# EAGLE design CameraTrigger (EAGLE 7.6.0)
CNAME: Aerometrex Multiple Camera Trigger; CREVISION: 1.3; DESIGNER: Tisham Dhar
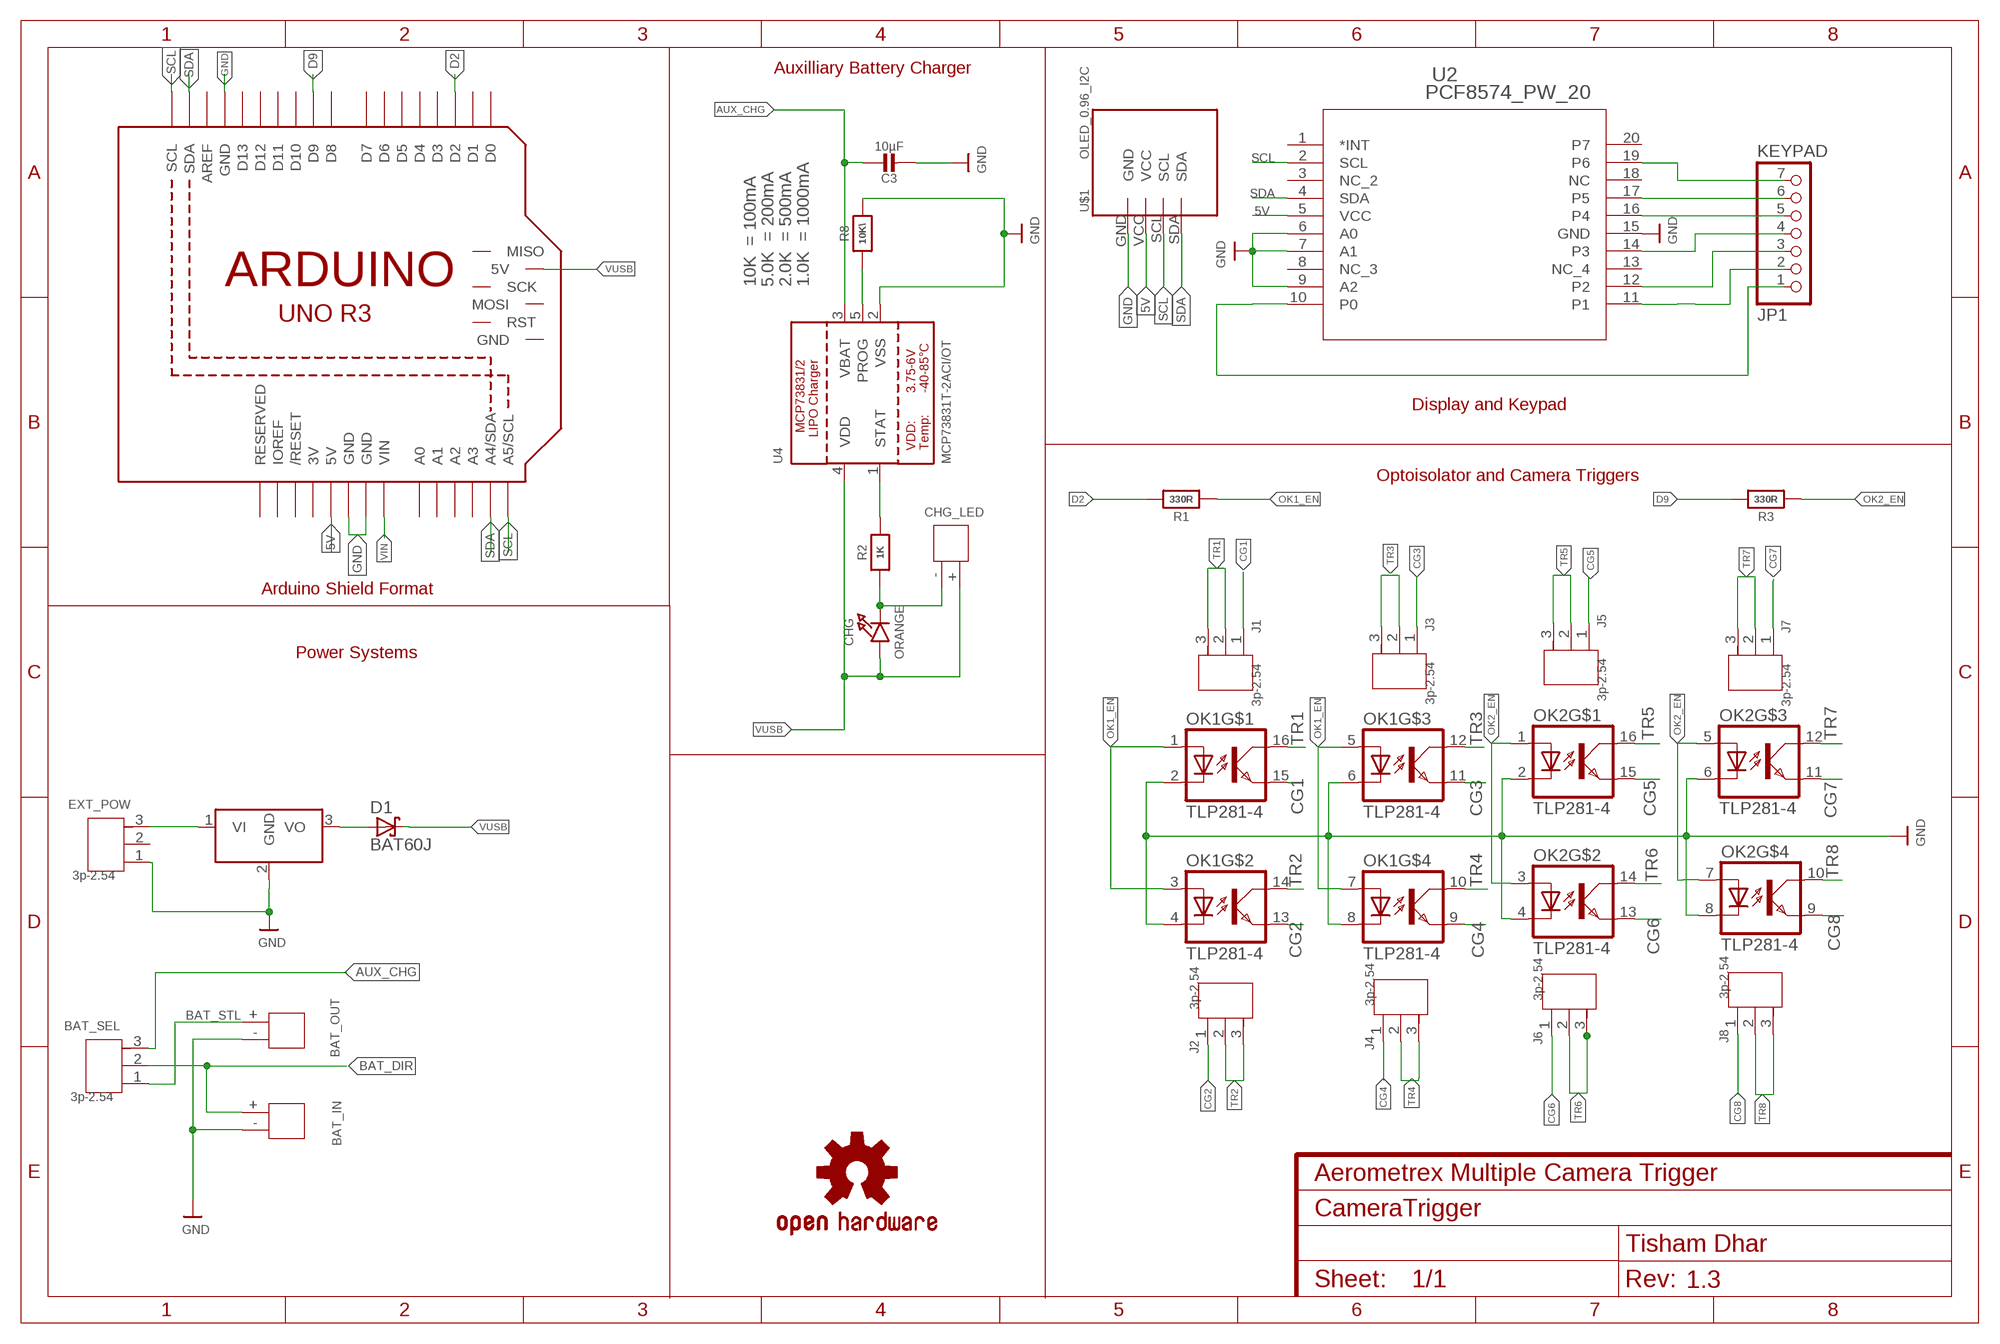
[diagram p0: schematic, sheet 1]

## Parts
BAT_IN  2p-2.0  DIP-JST-2P-2.0  [H2-2.0-6X4.5MM]
BAT_OUT  2p-2.0  DIP-JST-2P-2.0  [H2-2.0-6X4.5MM]
BAT_SEL  3p-2.54  DIP-FEMALE-JST(3P-2.54)  [HW3-2.54-7.62X6.6MM]
C3  10µF  CAP_CERAMIC0805-NOOUTLINE  [0805-NO]
CHG  ORANGE  LED0805_NOOUTLINE  [CHIPLED_0805_NOOUTLINE]
CHG_LED  2p-2.0  DIP-JST-2P-2.0  [H2-2.0-6X4.5MM]
D1  BAT60J  [SOD323_ST]
EXT_POW  3p-2.54  DIP-FEMALE-JST(3P-2.54)  [HW3-2.54-7.62X6.6MM]
J1  3p-2.54  DIP-FEMALE-JST(3P-2.54)  [HW3-2.54-7.62X6.6MM]
J2  3p-2.54  DIP-FEMALE-JST(3P-2.54)  [HW3-2.54-7.62X6.6MM]
J3  3p-2.54  DIP-FEMALE-JST(3P-2.54)  [HW3-2.54-7.62X6.6MM]
J4  3p-2.54  DIP-FEMALE-JST(3P-2.54)  [HW3-2.54-7.62X6.6MM]
J5  3p-2.54  DIP-FEMALE-JST(3P-2.54)  [HW3-2.54-7.62X6.6MM]
J6  3p-2.54  DIP-FEMALE-JST(3P-2.54)  [HW3-2.54-7.62X6.6MM]
J7  3p-2.54  DIP-FEMALE-JST(3P-2.54)  [HW3-2.54-7.62X6.6MM]
J8  3p-2.54  DIP-FEMALE-JST(3P-2.54)  [HW3-2.54-7.62X6.6MM]
JP1  KEYPAD  PINHD-1X7  [1X07]
LOGO1  OSHW-LOGOM  [OSHW-LOGO-M]
M1  ARDUINO_R3_ICSP  [ARDUINOR3_ICSP]
OK1  TLP281-4  [MINI-FLAT-16]
OK2  TLP281-4  [MINI-FLAT-16]
OKI-78SR-5  DCDC_OKI-78SR  [OKI-78SRH]
R1  330R  RESISTOR_0603_NOOUT  [0603-NO]
R2  1K  RESISTOR_0603_NOOUT  [0603-NO]
R3  330R  RESISTOR_0603_NOOUT  [0603-NO]
R8  10K\  RESISTOR_0603_NOOUT  [0603-NO]
U2  PCF8574_PW_20  [PW20]
U4  MCP73831T-2ACI/OT  MCP73831/2  [SOT23-5]
U$1  OLED_0.96_I2C  [OLED_0.96_I2C]

## Nets
5V [PWR]: M1.5V U2.5(VCC) U$1.VCC
AUX_CHG [PWR]: BAT_SEL.3 C3.1 U4.3(VBAT)
BAT_DIR [PWR]: BAT_IN.+ BAT_SEL.2
BAT_STL [PWR]: BAT_OUT.+ BAT_SEL.1
CG1: J1.1 OK1.15(EMIT)
CG2: J2.1 OK1.13(EMIT)
CG3: J3.1 OK1.11(EMIT)
CG4: J4.1 OK1.9(EMIT)
CG5: J5.1 OK2.15(EMIT)
CG6: J6.1 OK2.13(EMIT)
CG7: J7.1 OK2.11(EMIT)
CG8: J8.1 OK2.9(EMIT)
D2: M1.D2 R1.2
D9: M1.D9 R3.2
GND [PWR]: BAT_IN.- BAT_OUT.- C3.2 EXT_POW.1 M1.GND M1.GND@1(GND) M1.GND@3(GND) OK1.2(C) OK1.4(C) OK1.6(C) OK1.8(C) OK2.2(C) OK2.4(C) OK2.6(C) OK2.8(C) OKI-78SR-5.2(GND) R8.2 U2.6(A0) U2.7(A1) U2.9(A2) U2.15(GND) U4.2(VSS) U$1.GND
K1: JP1.1 U2.10(P0)
K2: JP1.2 U2.11(P1)
N$1: CHG.C CHG_LED.- R2.1
N$2 [PWR]: D1.A OKI-78SR-5.3(VO)
N$3: R2.2 U4.1(STAT)
N$4: R8.1 U4.5(PROG)
N$32: JP1.7 U2.19(P6)
N$33: JP1.6 U2.17(P5)
N$34: JP1.5 U2.16(P4)
N$36: JP1.4 U2.14(P3)
N$37: JP1.3 U2.12(P2)
OK1_EN: OK1.1(A) OK1.3(A) OK1.5(A) OK1.7(A) R1.1
OK2_EN: OK2.1(A) OK2.3(A) OK2.5(A) OK2.7(A) R3.1
SCL: M1.A5(A5/SCL) M1.SCL U2.2(SCL) U$1.SCL
SDA: M1.A4(A4/SDA) M1.SDA U2.4(SDA) U$1.SDA
TR1: J1.2 J1.3 OK1.16(COL)
TR2: J2.2 J2.3 OK1.14(COL)
TR3: J3.2 J3.3 OK1.12(COL)
TR4: J4.2 J4.3 OK1.10(COL)
TR5: J5.2 J5.3 OK2.16(COL)
TR6: J6.2 J6.3 OK2.14(COL)
TR7: J7.2 J7.3 OK2.12(COL)
TR8: J8.2 J8.3 OK2.10(COL)
VEXT [PWR]: EXT_POW.3 OKI-78SR-5.1(VI)
VIN [PWR]: M1.VIN
VUSB [PWR]: CHG.A CHG_LED.+ D1.C M1.5V_ICSP(5V) U4.4(VDD)
Unconnected: EXT_POW.2 M1.A0 M1.A1 M1.A2 M1.A3 M1.AREF M1.D0 M1.D1 M1.D3 M1.D4 M1.D5 M1.D6 M1.D7 M1.D8 M1.D10 M1.D11 M1.D12 M1.D13 M1.GND@2(GND) M1.IOREF M1.MISO M1.MOSI M1.RESERVED M1.RESET(/RESET) M1.RESET_ICSP(RST) M1.SCK U2.1(*INT) U2.3(NC_2) U2.8(NC_3) U2.13(NC_4) U2.18(NC) U2.20(P7)

## Notes on the sheet
- Auxilliary Battery Charger
- 10K  = 100mA | 5.0K  = 200mA | 2.0K  = 500mA | 1.0K  = 1000mA
- Display and Keypad
- Optoisolator and Camera Triggers
- Arduino Shield Format
- Power Systems

## Power pins joined to a net without a drawn wire
3V: M1.3V

## Library data of the parts
BAT_IN BAT_OUT CHG_LED = Seeed-OPL-Connector:DIP-JST-2P-2.0: 320110049
BAT_SEL EXT_POW J1-J8 = Seeed-OPL-Connector:DIP-FEMALE-JST(3P-2.54): 320110056; MPN: B101-103A0BSBA1
C3 = microbuilder:CAP_CERAMIC: Ceramic Capacitors For new designs, use the packages preceded by an '_' character since they are more reliable: The following footprints should be used on most boards: _0402 - Standard footprint for regular board layouts _0603 - Standard footprint for regular board layouts _0805 - Standard footprint for regular board layouts _1206 - Standard footprint for regular board layouts For extremely tight-pitch boards where space is at a premium, the following 'micro-pitch' footprints can be used (smaller pads, no silkscreen outline, etc.): _0402MP - Micro-pitch footprint for very dense/compact boards _0603MP - Micro-pitch footprint for very dense/compact boards _0805MP - Micro-pitch footprint for very dense/compact boards _1206MP - Micro-pitch footprint for very dense/compact boards
CHG = microbuilder:LED: LED 0603 - 0603 Surface Mount Package 2mA: Green LED - Low Power (3.9mcd, 2ma, 1.7Vf) - Digikey: 475-2709-2-ND Orange LED - Low Power (9.8mcd, 2ma, 1.8Vf) - Digikey: 475-1194-2-ND Red LED - Low Power (5mcd, 2ma, 1.8Vf) - Digikey: 475-1195-2-ND Yellow LED - Low Power (7mcd, 2ma, 1.8Vf) - Digikey: 475-1196-2-ND 5mA: Blue LED - Low Power (17mcd, 5ma, 2.9Vf) - Digikey: LNJ937W8CRACT-ND 0805 - 0805 Surface Mount Package 2mA: Red LED (8.8mcd, 2mA, 1.8Vf, Clear) - Low Power [Digikey: 475-2510-1-ND] Green LED (5mcd, 2mA, 1.8Vf, Clear) - Low Power [Digikey: 475-2730-1-ND] Yellow LED (11.3mcd, 2mA, 1.8Vf, Clear) - Low Power [Digikey: 475-2555-1-ND] 20mA: Red LED (104mcd, 20mA, Diffused) - LS R976 [Digikey: 475-1278-6-ND] Red LED (12mcd, 20mA, 2.0Vf, Clear) - APT2012EC [Digikey: 754-1128-1-ND] Green LED (15mcd, 20mA, 2.2Vf, Clear) - APT2012GC [Digikey: 754-1131-1-ND] Orange LED (160mcd, 20mA, 2.1Vf, Clear) - APT2012SECK [Digikey: 754-1130-1-ND] 1206 - 1206 Surface Mount Package Green LED (26mcd, 20mA, Diffused) - LG N971 [Digikey: 475-1407-6-ND] Red LED (15mcd, 20mA, Diffused) - LH N974 [Digikey: 475-1416-6-ND] Cree - Cree High-Power Surface Mount LEDs XPEBWT-L1-0000-00D50 - White 111lm 350mA 2.9Vf 6200K 110° XTEAWT-00-0000-00000LEE3 - White 114lm 350mA 2.85Vf 5000K 115° Everlight - Everlight 45-21 Series Surface Mount LEDs 45-21/QK2C-B2832AC2CB2/2T - Warm White 2000mcd 20mA 3.25Vf 3050K 120° 45-21/LK2C-B38452C4CB2/2T - Nuetral White 2000mcd 20mA 3.25Vf 4150K 120° 45-21/LK2C-B50634C6CB2/2T - Cold White 2200mcd 20mA 3.25Vf 5650K 120° PLCC2 Reverse Mount LS T77K-J1L2-1-0-2-R18-Z - Red 11.25mcd 2mA 1.8Vf 630nm 120° LO T77K-L1M2-24-Z - Orange 19.6mcd 2mA 1.8Vf 606nm 120° LY T77K-K2M1-26-Z - Yellow 15.7mcd 2mA 1.8Vf 587nm 120°
D1 = diode:BAT60J: Schottky barrier diode Source: www.st.com, BAT60J.pdf
JP1 = pinhead:PINHD-1X7: PIN HEADER
LOGO1 = SparkFun-Aesthetics:OSHW-LOGO: Open Source Hardware Logo This logo indicates the piece of hardware it is found on incorporates a OSHW license and/or adheres to the definition of open source hardware found here: http://freedomdefined.org/OSHW
M1 = adafruit:ARDUINO_R3_ICSP
OK1 OK2 = optocoupler:TLP281-4: TOSHIBA PHOTOCOUPLER GaAs IRED & PHOTO-TRANSISTOR Source: http://www.alldatasheet.com/datasheet-pdf/pdf/32424/TOSHIBA/TLP281.html214960/TOSHIBA/TLP281-4.html
OKI-78SR-5 = carrilib:DCDC_OKI-78SR: 4.95W DC/DC Converter Manufacturer: Murata Part Number: OKI-78SR-5/1.5-W36H-C OKI-78SR-3.3/1.5-W36H-C
R1-R3 R8 = microbuilder:RESISTOR: Resistors For new designs, use the packages preceded by an '_' character since they are more reliable: The following footprints should be used on most boards: _0402 - Standard footprint for regular board layouts _0603 - Standard footprint for regular board layouts _0805 - Standard footprint for regular board layouts _1206 - Standard footprint for regular board layouts For extremely tight-pitch boards where space is at a premium, the following 'micro-pitch' footprints can be used (smaller pads, no silkscreen outline, etc.): _0402MP - Micro-pitch footprint for very dense/compact boards _0603MP - Micro-pitch footprint for very dense/compact boards _0805MP - Micro-pitch footprint for very dense/compact boards _1206MP - Micro-pitch footprint for very dense/compact boards
U2 = PCF8574:PCF8574_PW_20; DATASHEETURL: http://www.ti.com/lit/gpn/PCF8574; DESCRIPTION: Remote 8-Bit I/O Expander for I2C-Bus; FAMILY_NAME: I2C IO EXPANDER; GENERIC_PART_NUMBER: PCF8574; INDUSTRY_STD_PKG_TYPE: TSSOP; MANUFACTURER: Texas Instruments; MANUFACTURER_PART_NUMBER: pcf8574_pw_20; PACKAGE_DESIGNATOR: PW; PIN_COUNT: 20; VENDOR: Texas Instruments
U4 = microbuilder:MCP73831/2: MCP73831/2 LIPO Charger VDD: 3.75 - 6V Temp -40 - 85°C Programmable Charge Rate: 15-500mA NOTE: STAT is a tri-state logic output on the MCP73831 and an open-drain output on the MCP73832. SOT23-5 with 4.2V output and tri-state logic on STAT = MCP73831T-2ACI/OT
U$1 = tft_1.8_1.44_oled_0.96:OLED_0.96_I2C

## Net classes
0 default: width 0.254 mm, drill 0.33 mm, clearance 0.203 mm
1 PWR: width 0.406 mm, drill 0.356 mm, clearance 0.254 mm

## Board
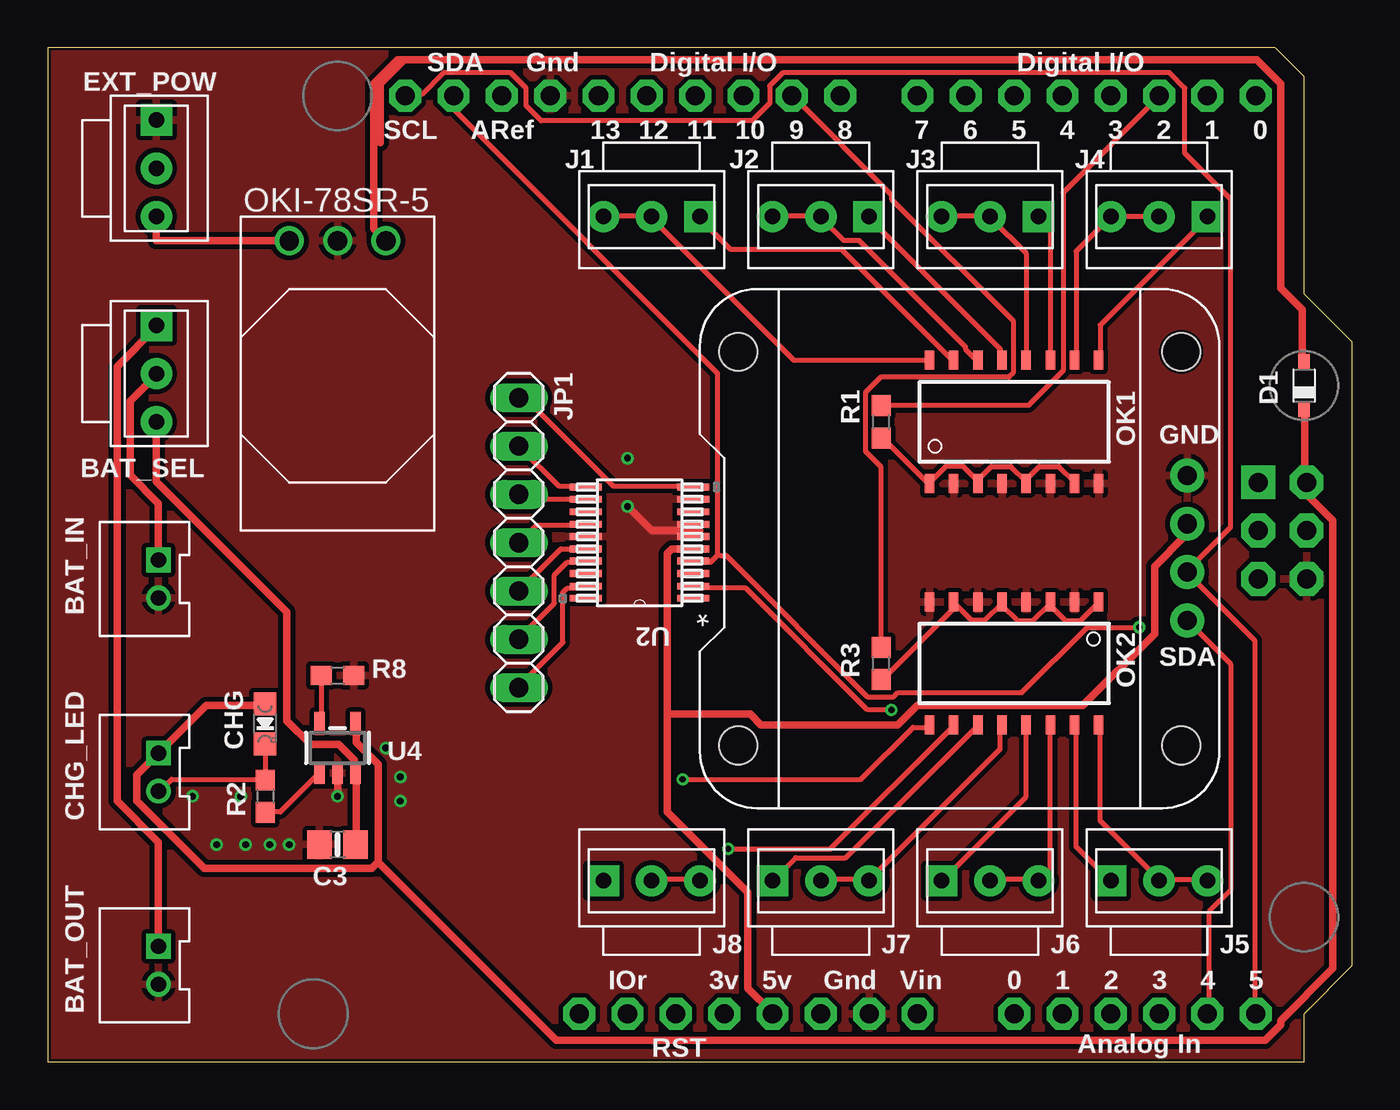
[diagram p1: board, top side]
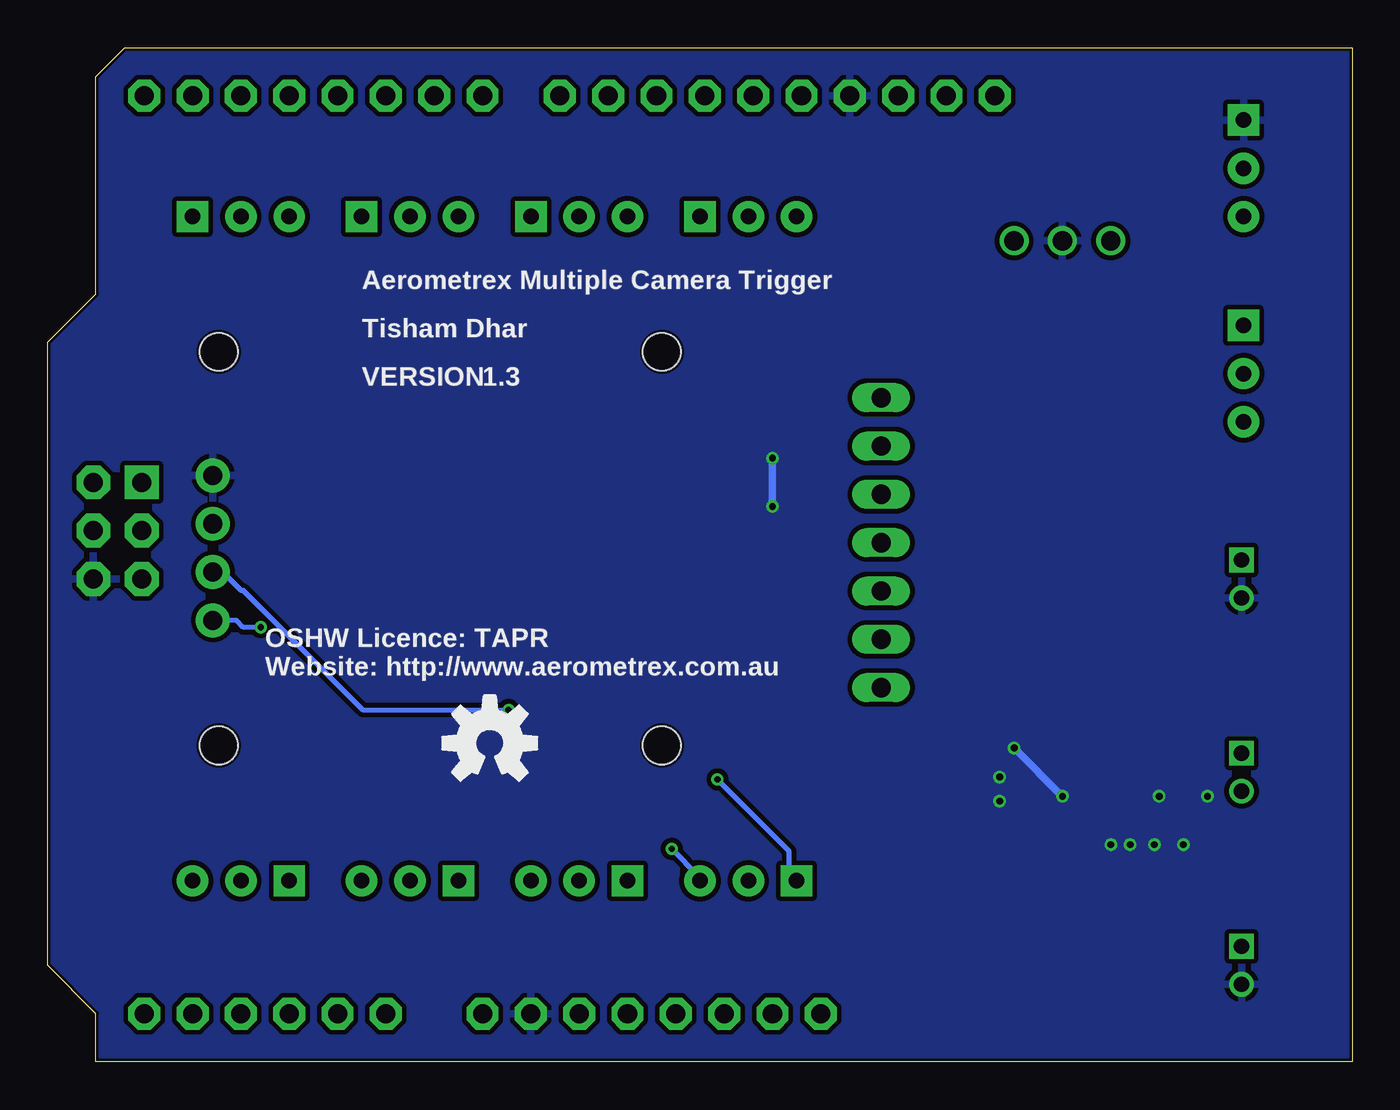
[diagram p2: board, bottom side, seen from below]

Size 68.58 x 53.34 mm. Coordinates in mm from the lower left corner, seen from the top.
Copper layers (1*16): Top 0.035mm / dielectric 1.5mm / Bottom 0.035mm
Design rules "hackvana": minimum track width 6mil, minimum drill 0.3mm, track to track 6mil, track to pad 6mil, pad to pad 6mil, via to via 6mil, smd to smd 0mil, copper to edge 6mil, drill to drill 6mil, minimum pad ring 10mil, minimum via ring 6mil, stop-mask expansion 2mil, vias tented up to drill 100mil, thermal gap 10mil

### Footprints (pad centres in the part's own frame; a part is rotated, then mirrored left to right if it is on the bottom)
H2-2.0-6X4.5MM = drill 0.8 pad 1.3 square: + -1,0.75 | drill 0.8 pad 1.3: - 1,0.75
HW3-2.54-7.62X6.6MM = drill 0.813 pad 1.651 square: 1 2.54,0 | drill 0.813 pad 1.651: 2 0,0; 3 -2.54,0
0805-NO = smd 1.3 x 1.5: 1 -0.95,0; 2 0.95,0
CHIPLED_0805_NOOUTLINE = smd 1.2 x 1.2: A 0,-1.05; C 0,1.05
SOD323_ST = smd 0.8 x 0.6: A 1.25,0; C -1.25,0
1X07 = drill 1.016 long: 1 -7.62,0; 2 -5.08,0; 3 -2.54,0; 4 0,0; 5 2.54,0; 6 5.08,0; 7 7.62,0
ARDUINOR3_ICSP = drill 1 pad 1.676 octagon: 3V 35.56,2.54; 5V 38.1,2.54; A0 50.8,2.54; A1 53.34,2.54; A2 55.88,2.54; A3 58.42,2.54; A4 60.96,2.54; A5 63.5,2.54; AREF 23.876,50.8; D0 63.5,50.8; D1 60.96,50.8; D2 58.42,50.8; D3 55.88,50.8; D4 53.34,50.8; D5 50.8,50.8; D6 48.26,50.8; D7 45.72,50.8; D8 41.656,50.8; D9 39.116,50.8; D10 36.576,50.8; D11 34.036,50.8; D12 31.496,50.8; D13 28.956,50.8; GND 26.416,50.8; GND@1 43.18,2.54; GND@2 40.64,2.54; IOREF 30.48,2.54; RESERVED 27.94,2.54; RESET 33.02,2.54; SCL 18.796,50.8; SDA 21.336,50.8; VIN 45.72,2.54 | drill 1 pad 1.778 octagon: 5V_ICSP 66.167,30.48; GND@3 66.167,25.4; MOSI 66.167,27.94; RESET_ICSP 63.627,25.4; SCK 63.627,27.94 | drill 1 pad 1.778 square: MISO 63.627,30.48
MINI-FLAT-16 = smd 1 x 0.5: 1 -3.24,4.445; 2 -3.24,3.175; 3 -3.24,1.905; 4 -3.24,0.635; 5 -3.24,-0.635; 6 -3.24,-1.905; 7 -3.24,-3.175; 8 -3.24,-4.445; 9 3.24,-4.445; 10 3.24,-3.175; 11 3.24,-1.905; 12 3.24,-0.635; 13 3.24,0.635; 14 3.24,1.905; 15 3.24,3.175; 16 3.24,4.445
OKI-78SRH = drill 1.016: 1 2.54,0; 2 0,0; 3 -2.54,0
0603-NO = smd 1.1 x 1: 1 -0.85,0; 2 0.85,0
PW20 = smd 1.676 x 0.356: 1 -2.819,2.921; 2 -2.819,2.286; 3 -2.819,1.626; 4 -2.819,0.965; 5 -2.819,0.33; 6 -2.819,-0.33; 7 -2.819,-0.965; 8 -2.819,-1.626; 9 -2.819,-2.286; 10 -2.819,-2.921; 11 2.819,-2.921; 12 2.819,-2.286; 13 2.819,-1.626; 14 2.819,-0.965; 15 2.819,-0.33; 16 2.819,0.33; 17 2.819,0.965; 18 2.819,1.626; 19 2.819,2.286; 20 2.819,2.921
SOT23-5 = smd 0.55 x 1.2: 1 -0.95,-1.3; 2 0,-1.3; 3 0.95,-1.3; 4 0.95,1.3; 5 -0.95,1.3
OLED_0.96_I2C = drill 1 pad 1.778: GND -4.17,11.63; SCL 0.91,11.63; SDA 3.45,11.63; VCC -1.63,11.63 | hole 2: -10.67,-11.97; 10.03,-11.97; 10.03,11.33; -10.67,11.33

### Placement (x,y rotation side)
BAT_IN  5.08,25.4 270 top
BAT_OUT  5.08,5.08 270 top
BAT_SEL  5.71,36.2 90 top
C3  15.24,11.43 180 top
CHG  11.43,17.78 180 top
CHG_LED  5.08,15.24 270 top
D1  66.04,35.56 90 top
EXT_POW  5.71,46.99 90 top
J1  31.75,44.45 0 top
J2  40.64,44.45 0 top
J3  49.53,44.45 0 top
J4  58.42,44.45 0 top
J5  58.42,9.53 180 top
J6  49.53,9.53 180 top
J7  40.64,9.53 180 top
J8  31.75,9.53 180 top
JP1  24.77,27.3 270 top
LOGO1  45.34,16.76 0 bottom
M1  0,0 0 top
OK1  50.8,33.66 90 top
OK2  50.8,20.95 270 top
OKI-78SR-5  15.24,43.18 180 top
R1  43.81,33.66 90 top
R2  11.43,13.97 270 top
R3  43.81,20.95 90 top
R8  15.24,20.32 0 top
U2  31.11,27.3 180 top
U4  15.24,16.51 0 top
U$1  48.26,26.67 270 top

### Tracks (layer width: path | path; a pad name or v marks a point on that pad's centre or on a via)
5V
  Top 0.406: 32.58,18.29 32.58,13.14 36.8,8.91 36.8,3.89 38.06,2.63 M1.5V | 32.58,18.29 32.58,26.75 32.8,26.98 33.83,26.98 U2.5 | U$1.VCC 59.78,28.23 59.78,27.66 58.18,26.06 58.18,22.52 54.41,18.75 45.72,18.75 44.69,17.72 37.49,17.72 36.92,18.29 32.69,18.29 32.58,18.29
AUX_CHG
  Top 0.406: C3.1 16.23,11.43 16.23,15.2 U4.3 16.12,15.32 16.12,15.89 15.32,16.69 13.83,16.69 12.57,17.95 12.57,23.66 5.71,30.52 5.71,33.6 BAT_SEL.3
BAT_DIR
  Top 0.406: BAT_IN.+ 5.83,29.38 4.34,30.86 4.34,34.75 5.71,36.12 BAT_SEL.2
BAT_STL
  Top 0.406: BAT_OUT.+ 5.83,6.17 5.83,11.54 3.66,13.72 3.66,36.58 5.71,38.63 BAT_SEL.1
CG1
  Top 0.254: OK1.15 47.55,36.92 41.72,42.75 35.89,42.75 34.29,44.35 J1.1
CG2
  Top 0.254: OK1.13 50.06,36.92 50.06,37.49 43.2,44.35 J2.1
CG3
  Top 0.254: OK1.11 52.69,36.92 52.69,43.78 52.12,44.35 J3.1
CG4
  Top 0.254: OK1.9 55.32,36.92 55.32,38.75 60.92,44.35 J4.1
CG5
  Top 0.254: OK2.15 54.06,17.6 54.06,11.32 55.78,9.6 J5.1
CG6
  Top 0.254: OK2.13 51.44,17.6 51.44,13.95 47.09,9.6 J6.1
CG7
  Top 0.254: OK2.11 48.81,17.6 41.95,10.74 39.32,10.74 38.18,9.6 J7.1
CG8  (via drill 0.33)
  Top 0.254: v33.38,14.86 42.75,14.86 45.49,17.6 46.29,17.6 OK2.9
  Bottom 0.254: v33.38,14.86 29.6,11.09 29.6,9.94 29.26,9.6 J8.1
D2
  Top 0.254: R1.2 43.89,34.52 51.55,34.52 53.38,36.35 53.38,45.72 58.41,50.75 M1.D2
D9
  Top 0.254: R3.2 43.78,21.83 43.78,31.32 42.98,32.12 42.98,35.2 43.78,36.01 50.52,36.01 50.75,36.23 50.75,38.98 44.35,45.38 44.35,45.61 39.2,50.75 M1.D9
GND  (via drill 0.36)
  Top 0.406: v30.48,29.21 31.75,27.94 34.29,27.94 U2.6 | U4.2 15.24,15.24 U4.2 | U4.2 v15.24,13.97
  Bottom 0.406: v30.48,29.21 v30.48,31.75 | v15.24,13.97 v17.78,16.51
  other vias: 7.62,13.97 8.89,11.43 10.16,13.97 11.68,11.43 18.54,14.99 18.54,13.72 12.7,11.43 10.41,11.43
  pour Bottom: 0,53.34 68.58,53.34 68.58,0 0,0
  pour Top: 0,53.34 68.58,53.34 68.58,0 0,0
K1
  Top 0.254: U2.10 33.83,30.29 29.72,30.29 25.15,34.86 24.8,34.86 JP1.1
K2
  Top 0.254: U2.11 28.23,30.29 26.86,30.29 24.8,32.35 JP1.2
N$1
  Top 0.254: CHG.C 11.43,16.69 11.43,14.86 R2.1 11.32,14.86 6.51,14.86 5.94,14.29 CHG_LED.-
N$2
  Top 0.406: 19.05,52.69 18.75,52.69 17.49,51.44 17.49,48.35 | 19.05,52.69 63.55,52.69 64.81,51.44 64.81,40.69 65.95,39.55 65.95,36.92 D1.A | OKI-78SR-5.3 17.14,43.81 17.14,51.44 18.41,52.7 19.05,52.7 19.05,52.69
N$3
  Top 0.254: R2.2 11.43,13.14 12.23,13.14 U4.1
N$4
  Top 0.254: R8.1 14.4,20.23 14.4,17.83 U4.5
N$32
  Top 0.254: U2.19 28.23,24.92 27.32,24.92 27.09,24.69 27.09,22.06 24.8,19.77 JP1.7
N$33
  Top 0.254: U2.17 28.23,26.29 27.32,26.29 26.63,25.6 26.63,24.12 24.8,22.29 JP1.6
N$34
  Top 0.254: U2.16 28.23,26.98 26.98,26.98 24.8,24.8 JP1.5
N$36
  Top 0.254: U2.14 28.23,28.23 25.72,28.23 24.8,27.32 JP1.4
N$37
  Top 0.254: U2.12 28.23,29.6 25.03,29.6 24.8,29.83 JP1.3
OK1_EN
  Top 0.254: OK1.7 53.95,30.52 53.15,31.32 52.12,31.32 51.44,30.63 OK1.5 51.44,30.52 50.63,31.32 49.61,31.32 48.92,30.63 OK1.3 48.92,30.52 48.12,31.32 47.21,31.32 46.41,30.52 OK1.1 46.29,30.4 43.89,32.8 R1.1
OK2_EN
  Top 0.254: 47.78,24 48.58,23.2 49.26,23.2 50.18,24.12 OK2.5 50.18,24 50.98,23.2 51.78,23.2 52.69,24.12 OK2.3 52.69,24 53.49,23.2 54.29,23.2 55.21,24.12 OK2.1 | 47.78,24 47.66,24.12 OK2.7 47.78,24 | 47.78,24 43.89,20.12 R3.1
SCL  (via drill 0.33)
  Top 0.254: v44.35,18.52 43.09,18.52 36.69,24.92 33.95,24.92 U2.2 | M1.A5 63.44,2.63 63.44,22.17 59.89,25.72 U$1.SCL 59.89,25.83 62.18,28.12 62.18,45.38 59.78,47.78 59.78,51.21 58.98,52.01 38.63,52.01 37.95,51.32 37.95,50.41 37.03,49.49 25.95,49.49 25.15,50.29 25.15,51.21 24.35,52.01 20.8,52.01 19.66,50.86 18.86,50.86 M1.SCL
  Bottom 0.254: v44.35,18.52 52.01,18.52 58.29,24.8 58.41,24.8 59.32,25.72 59.78,25.72 U$1.SCL
SDA  (via drill 0.33)
  Top 0.254: M1.A4 61.04,2.63 61.04,7.89 62.18,9.03 62.18,20.92 59.89,23.2 U$1.SDA | 35.2,26.63 34.86,26.29 33.95,26.29 U2.4 | 35.2,26.63 35.2,36.23 21.37,50.06 21.37,50.75 M1.SDA | v57.38,22.86 54.63,22.86 51.21,19.43 44.69,19.43 44.46,19.2 43.09,19.2 35.66,26.63 35.32,26.63 35.2,26.63
  Bottom 0.254: v57.38,22.86 58.29,22.86 58.64,23.2 59.78,23.2 U$1.SDA
TR1
  Top 0.254: OK1.16 46.29,36.92 39.2,36.92 31.77,44.35 J1.2 31.66,44.46 29.26,44.46 J1.3
TR2
  Top 0.254: OK1.14 48.81,36.92 48.23,37.49 48.23,37.6 42.63,43.2 41.83,43.2 40.69,44.35 J2.2 40.58,44.46 38.18,44.46 J2.3
TR3
  Top 0.254: OK1.12 51.44,36.92 51.44,42.52 49.61,44.35 J3.2 49.49,44.46 47.09,44.46 J3.3
TR4
  Top 0.254: OK1.10 54.06,36.92 54.06,42.63 55.78,44.35 J4.3 55.89,44.46 58.41,44.46 J4.2
TR5
  Top 0.254: OK2.16 55.32,17.6 55.32,12.69 58.41,9.6 J5.2 58.52,9.6 60.92,9.6 J5.3
TR6
  Top 0.254: OK2.14 52.69,17.6 52.69,10.17 52.12,9.6 J6.3 52.01,9.6 49.61,9.6 J6.2
TR7
  Top 0.254: OK2.12 50.06,17.6 50.06,16.46 43.2,9.6 J7.3 43.09,9.6 40.69,9.6 J7.2
TR8  (via drill 0.33)
  Top 0.254: v35.78,11.2 41.15,11.2 47.55,17.6 OK2.10 | J8.2 31.77,9.6 34.29,9.6 J8.3
  Bottom 0.254: v35.78,11.2 34.29,9.72 34.29,9.6 J8.3
VEXT
  Top 0.406: OKI-78SR-5.1 5.71,43.18 EXT_POW.3
VUSB
  Top 0.406: D1.C 66.06,34.29 66.06,30.52 M1.5V_ICSP 66.18,30.29 66.18,29.83 67.55,28.46 67.55,4.92 64.81,2.17 64.81,1.94 64.01,1.14 26.75,1.14 17.49,10.4 17.37,10.52 | CHG.A 11.43,18.75 8.34,18.75 5.94,16.34 CHG_LED.+ 5.71,16.12 4.69,15.09 4.69,13.72 8.23,10.17 17.03,10.17 17.37,10.52 | 17.37,10.52 17.37,15.66 16.23,16.8 16.23,17.72 U4.4

### Text on the board
tPlace: GND | SDA
bPlace: VERSION | OSHW Licence: TAPR / Website: http://www.aerometrex.com.au